# EAGLE schematic School System Wiring (EAGLE 7.6.0)
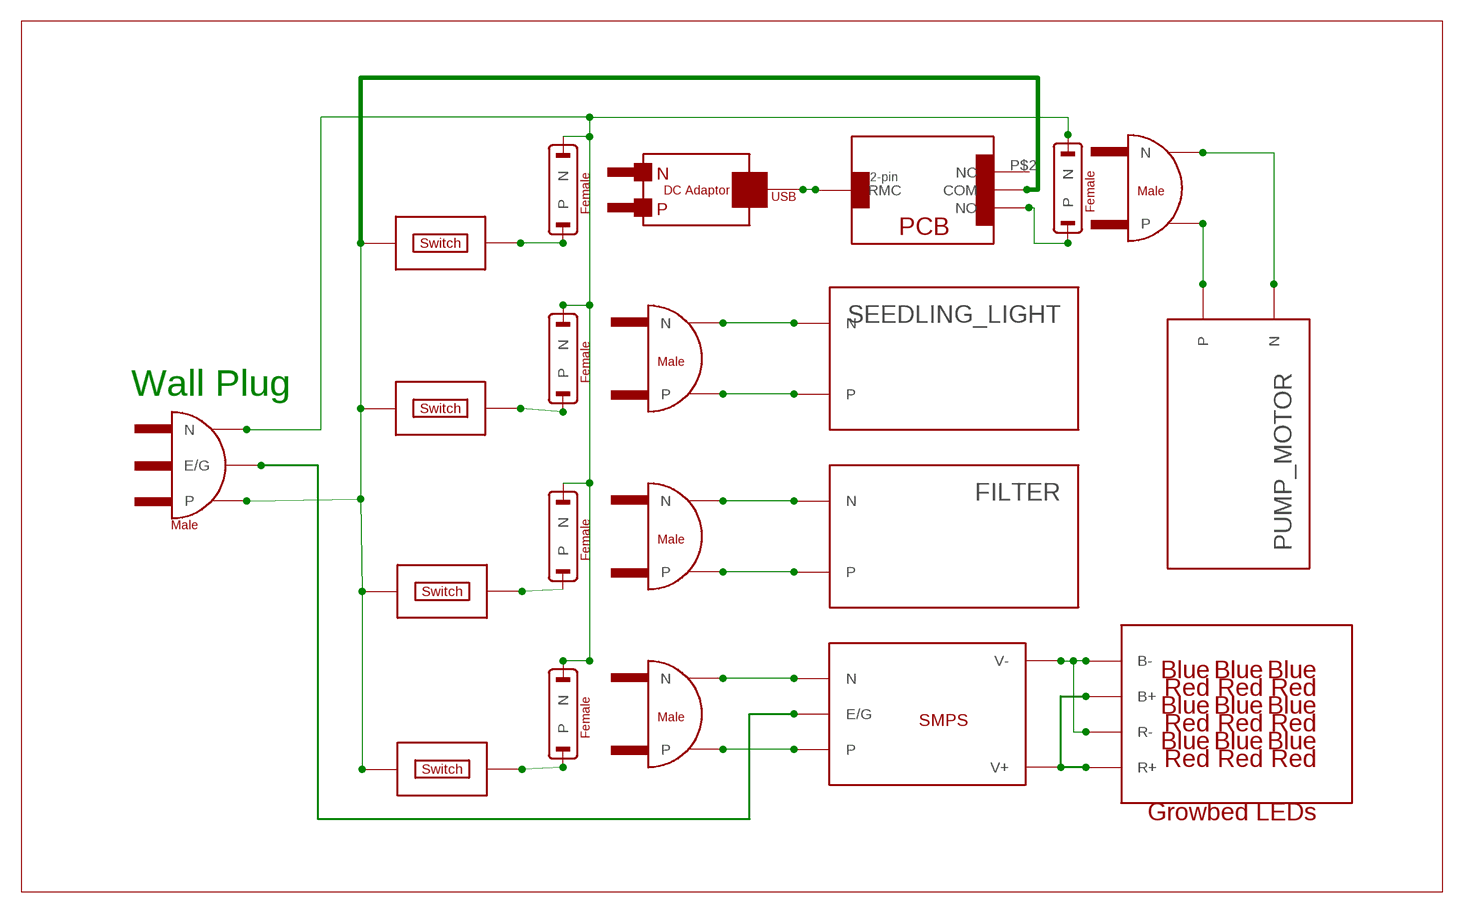
[diagram p0: schematic, sheet 1]

## Parts
FILTER  EQUIPMENT  [2PINS]
PUMP_MOTOR  EQUIPMENT  [2PINS]
SEEDLING_LIGHT  EQUIPMENT  [2PINS]
U$1  AC-PLUG-3  [3PINS]
U$2  AC-PLUG-2  [2PINS]
U$3  AC-PLUG-2  [2PINS]
U$4  AC-PLUG-2  [2PINS]
U$5  AC-PLUG-2  [2PINS]
U$6  DC_ADAPTOR  [1PIN]
U$7  SCHOOL_PCB  [4PINS]
U$10  GROWBED_LEDS  [4PINS]
U$11  SWITCH  [2PINS]
U$12  SWITCH  [2PINS]
U$13  SWITCH  [2PINS]
U$14  SWITCH  [2PINS]
U$15  SMPS  [5PINS]
X1  AC-JACK-2  [2PINS]
X2  AC-JACK-2  [2PINS]
X3  AC-JACK-2  [2PINS]
X4  AC-JACK-2  [2PINS]
X5  AC-JACK-2  [2PINS]

## Nets
N$1: U$1.2(P) U$11.1 U$12.1 U$13.1 U$14.1
N$2: U$11.2 X1.1(P)
N$3: U$13.2 X2.1(P)
N$4: U$12.2 X3.1(P)
N$5: U$14.2 X4.1(P)
N$6: U$1.3(N) X1.2(N) X2.2(N) X3.2(N) X4.2(N) X5.2(N)
N$7: SEEDLING_LIGHT.1(P) U$5.1(P)
N$8: SEEDLING_LIGHT.2(N) U$5.2(N)
N$9: FILTER.1(P) U$2.1(P)
N$10: FILTER.2(N) U$2.2(N)
N$11: U$3.1(P) U$15.P$3(P)
N$12: U$3.2(N) U$15.P$2(N)
N$13: U$15.P$1(E/G)
N$14: U$10.P$1(B+) U$10.P$3(R+) U$15.P$4(V+)
N$15: U$10.P$2(B-) U$10.P$4(R-) U$15.P$5(V-)
N$16: PUMP_MOTOR.1(P) U$4.1(P)
N$17: PUMP_MOTOR.2(N) U$4.2(N)
N$18: U$6.P$1
N$20: X5.1(P)
Unconnected: U$1.1(E/G) U$7.P$1(RMC) U$7.P$2(NC) U$7.P$3(COM) U$7.P$4(NO)

## Notes on the sheet
- Wall Plug

## Library data of the parts
FILTER PUMP_MOTOR SEEDLING_LIGHT = Crofters:EQUIPMENT: Equipments Filter, Pump Motor, Seedling Light
U$1 = Crofters:AC-PLUG-3: AC Plug, 3-Pin Male
U$2-U$5 = Crofters:AC-PLUG-2: AC Plug, 2-Pin Male
U$6 = Crofters:DC_ADAPTOR: DC Adaptor 5v
U$7 = Crofters:SCHOOL_PCB
U$10 = Crofters:GROWBED_LEDS: Growbed LEDs Red and Blue LED strips
U$11-U$14 = Crofters:SWITCH: Switch On-Off Switch
U$15 = Crofters:SMPS
X1-X5 = Crofters:AC-JACK-2: AC Jack, 2-Pin Female